# EAGLE design M7672 (EAGLE 6.6.0)
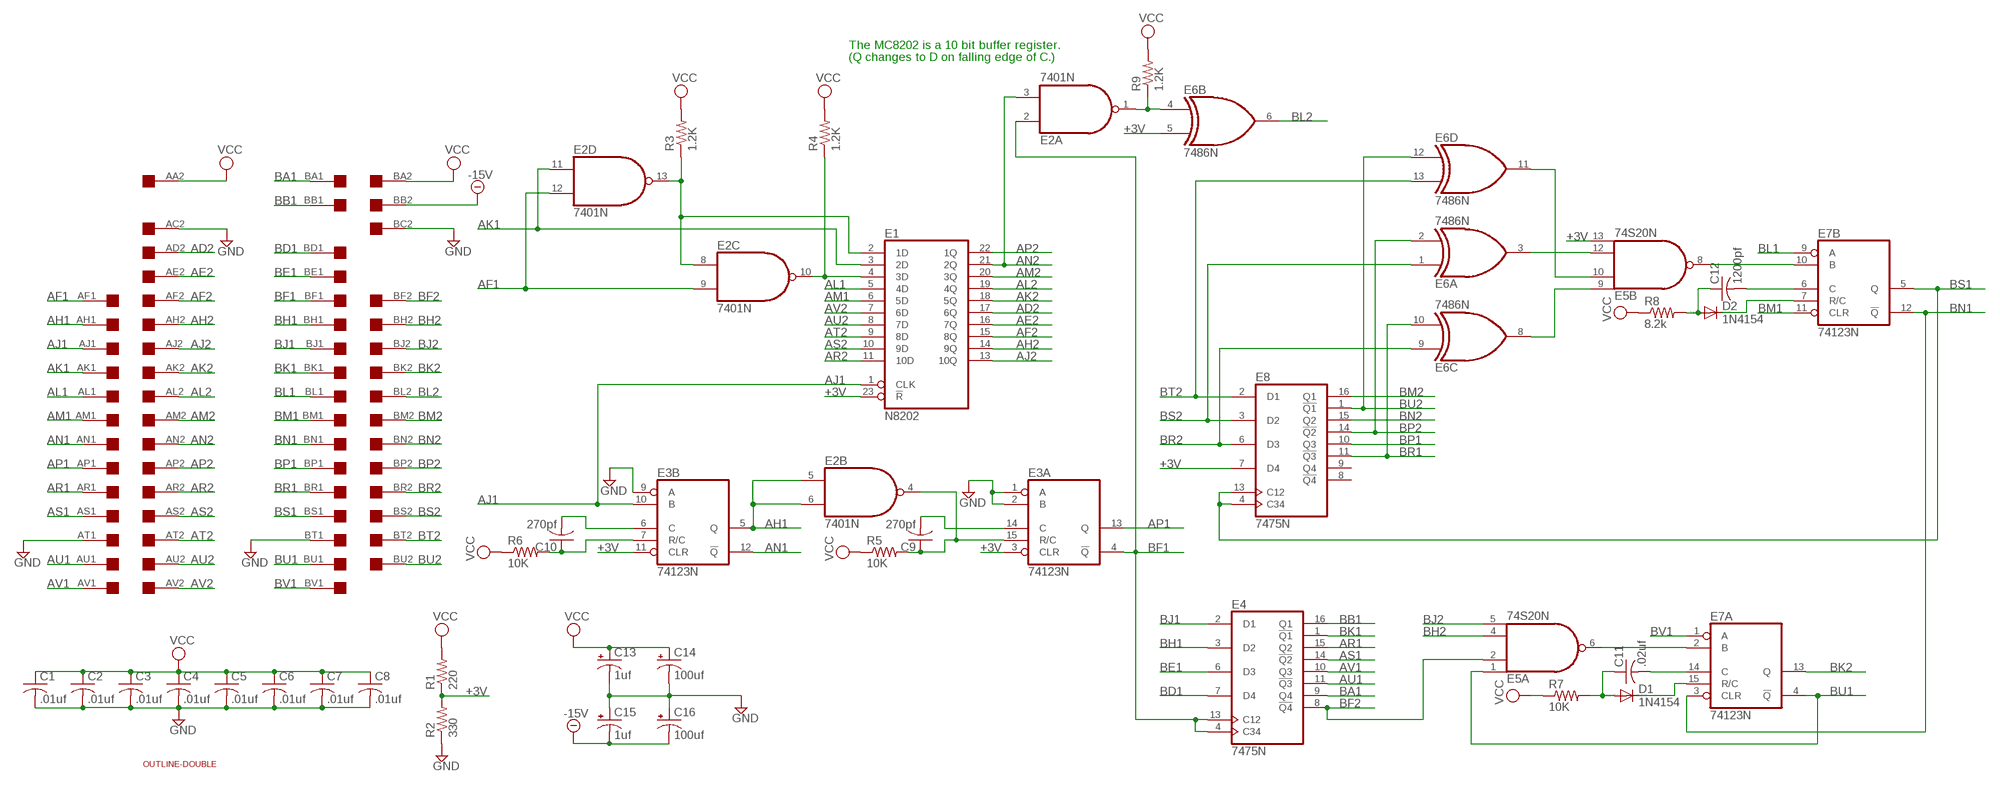
[diagram p0: schematic, sheet 1]

## Parts
C1  .01uf  C-US050-025X075  [C050-025X075]
C2  .01uf  C-US050-025X075  [C050-025X075]
C3  .01uf  C-US050-025X075  [C050-025X075]
C4  .01uf  C-US050-025X075  [C050-025X075]
C5  .01uf  C-US050-025X075  [C050-025X075]
C6  .01uf  C-US050-025X075  [C050-025X075]
C7  .01uf  C-US050-025X075  [C050-025X075]
C8  .01uf  C-US050-025X075  [C050-025X075]
C9  270pf  C-US050-025X075  [C050-025X075]
C10  270pf  C-US050-025X075  [C050-025X075]
C11  .02uf  C-US050-025X075  [C050-025X075]
C12  1200pf  C-US050-025X075  [C050-025X075]
C13  1uf  CPOL-USE30-10AXIAL  [E30-10]
C14  100uf  CPOL-USE30-10AXIAL  [E30-10]
C15  1uf  CPOL-USE30-10AXIAL  [E30-10]
C16  100uf  CPOL-USE30-10AXIAL  [E30-10]
D1  1N4154  1N4148DO35-10  [DO35-10]
D2  1N4154  1N4148DO35-10  [DO35-10]
E1  N8202  [DIL24]
E2  7401N  74LS01N  [DIL14]
E3  74123N  [DIL16]
E4  7475N  [DIL16]
E5  74S20N  [DIL14]
E6  7486N  [DIL14]
E7  74123N  [DIL16]
E8  7475N  [DIL16]
EDGE  DOUBLE  [EDGE-CON4]
R1  220  R-US_0207/10  [0207/10]
R2  330  R-US_0207/10  [0207/10]
R3  1.2K  R-US_0207/10  [0207/10]
R4  1.2K  R-US_0207/10  [0207/10]
R5  10K  R-US_0207/10  [0207/10]
R6  10K  R-US_0207/10  [0207/10]
R7  10K  R-US_0207/10  [0207/10]
R8  8.2k  R-US_0207/10  [0207/10]
R9  1.2K  R-US_0207/10  [0207/10]
U$2  OUTLINE-DOUBLE  [DOUBLE]

## Nets
+3V: E1.23(!R) E3.3(A:CLR) E3.11(B:CLR) E5.13(B:I3) E6.5(B:I1) E8.7(D4) R1.1 R2.2
-15V: C15.- C16.- EDGE.BB2
AD2: E1.17(6Q) EDGE.AD2
AE2: E1.16(7Q) EDGE.AE2
AF1: E2.9(C:I1) E2.12(D:I1) EDGE.AF1
AF2: E1.15(8Q) EDGE.AF2
AH1: E2.5(B:I0) E2.6(B:I1) E3.5(B:Q) EDGE.AH1
AH2: E1.14(9Q) EDGE.AH2
AJ1: E1.1(CLK) E3.10(B:B) EDGE.AJ1
AJ2: E1.13(10Q) EDGE.AJ2
AK1: E1.3(2D) E2.11(D:I0) EDGE.AK1
AK2: E1.18(5Q) EDGE.AK2
AL1: E1.5(4D) EDGE.AL1
AL2: E1.19(4Q) EDGE.AL2
AM1: E1.6(5D) EDGE.AM1
AM2: E1.20(3Q) EDGE.AM2
AN1: E3.12(B:!Q) EDGE.AN1
AN2: E1.21(2Q) E2.3(A:I1) EDGE.AN2
AP1: E3.13(A:Q) EDGE.AP1
AP2: E1.22(1Q) EDGE.AP2
AR1: E4.15(Q2) EDGE.AR1
AR2: E1.11(10D) EDGE.AR2
AS1: E4.14(!Q2) EDGE.AS1
AS2: E1.10(9D) EDGE.AS2
AT2: E1.9(8D) EDGE.AT2
AU1: E4.11(!Q3) EDGE.AU1
AU2: E1.8(7D) EDGE.AU2
AV1: E4.10(Q3) EDGE.AV1
AV2: E1.7(6D) EDGE.AV2
BA1: E4.9(Q4) EDGE.BA1
BB1: E4.16(Q1) EDGE.BB1
BD1: E4.7(D4) EDGE.BD1
BE1: E4.6(D3) EDGE.BE1
BF1: E2.2(A:I0) E3.4(A:!Q) E4.4(C34) E4.13(C12) EDGE.BF1
BF2: E4.8(!Q4) E5.2(A:I1) EDGE.BF2
BH1: E4.3(D2) EDGE.BH1
BH2: E5.4(A:I2) EDGE.BH2
BJ1: E4.2(D1) EDGE.BJ1
BJ2: E5.5(A:I3) EDGE.BJ2
BK1: E4.1(!Q1) EDGE.BK1
BK2: E7.13(A:Q) EDGE.BK2
BL1: E7.9(B:A) EDGE.BL1
BL2: E6.6(B:O) EDGE.BL2
BM1: E7.11(B:CLR) EDGE.BM1
BM2: E8.16(Q1) EDGE.BM2
BN1: E7.3(A:CLR) E7.12(B:!Q) EDGE.BN1
BN2: E8.15(Q2) EDGE.BN2
BP1: E8.10(Q3) EDGE.BP1
BP2: E6.2(A:I1) E8.14(!Q2) EDGE.BP2
BR1: E6.10(C:I1) E8.11(!Q3) EDGE.BR1
BR2: E6.9(C:I0) E8.6(D3) EDGE.BR2
BS1: E7.5(B:Q) E8.4(C34) E8.13(C12) EDGE.BS1
BS2: E6.1(A:I0) E8.3(D2) EDGE.BS2
BT2: E6.13(D:I1) E8.2(D1) EDGE.BT2
BU1: E5.1(A:I0) E7.4(A:!Q) EDGE.BU1
BU2: E6.12(D:I0) E8.1(!Q1) EDGE.BU2
BV1: E7.1(A:A) EDGE.BV1
GND [power]: C1.2 C2.2 C3.2 C4.2 C5.2 C6.2 C7.2 C8.2 C13.- C14.- C15.+ C16.+ E3.1(A:A) E3.2(A:B) E3.9(B:A) EDGE.AC2 EDGE.AT1 EDGE.BC2 EDGE.BT1 R2.1
N$1: E1.2(1D) E2.8(C:I0) E2.13(D:O) R3.1
N$2: E1.4(3D) E2.10(C:O) R4.1
N$3: E2.1(A:O) E6.4(B:I0) R9.1
N$4: E5.12(B:I2) E6.3(A:O)
N$5: C10.1 E3.7(B:R/C) R6.2
N$6: C10.2 E3.6(B:C)
N$7: C9.1 E2.4(B:O) E3.15(A:R/C) R5.2
N$8: C9.2 E3.14(A:C)
N$9: E5.10(B:I1) E6.11(D:O)
N$10: E5.9(B:I0) E6.8(C:O)
N$12: E5.6(A:O) E7.2(A:B)
N$13: D1.C E7.15(A:R/C)
N$14: C11.2 E7.14(A:C)
N$15: C11.1 D1.A R7.2
N$16: E5.8(B:O) E7.10(B:B)
N$17: D2.C E7.7(B:R/C)
N$18: C12.2 E7.6(B:C)
N$19: C12.1 D2.A R8.2
VCC [power]: C1.1 C2.1 C3.1 C4.1 C5.1 C6.1 C7.1 C8.1 C13.+ C14.+ EDGE.AA2 EDGE.BA2 R1.2 R3.2 R4.2 R5.1 R6.1 R7.1 R8.1 R9.2
Unconnected: E8.8(!Q4) E8.9(Q4) EDGE.AA1 EDGE.AB1 EDGE.AB2 EDGE.AC1 EDGE.AD1 EDGE.AE1 EDGE.BC1 EDGE.BD2 EDGE.BE2 EDGE.BV2

## Notes on the sheet
- The MC8202 is a 10 bit buffer register.
- (Q changes to D on falling edge of C.)

## Power pins joined to a net without a drawn wire
GND: E1.12(GND) E2.7(P:GND) E3.8(P:GND) E4.12(GND) E5.7(P:GND) E6.7(P:GND) E7.8(P:GND) E8.12(GND)
VCC: E1.24(VCC) E2.14(P:VCC) E3.16(P:VCC) E4.5(VCC) E5.14(P:VCC) E6.14(P:VCC) E7.16(P:VCC) E8.5(VCC)

## Library data of the parts
C1-C12 = rcl:C-US: CAPACITOR, American symbol
C13-C16 = rcl:CPOL-US: POLARIZED CAPACITOR, American symbol
D1 D2 = diode:1N4148: DIODE high speed (Philips)
E1 = dec-con:N8202: 10 bit register
E2 = 74xx-us:74*01: Quad 2-input NAND gate, open collector
E3 E7 = 74xx-us:74*123: Retriggerable monostable MULTIVIBRATOR
E4 E8 = 74xx-us:74*75: 4-bit bistable LATCH
E5 = 74xx-us:74*20: Dual 4-input NAND gate
E6 = 74xx-us:74*86: Quad 2-input EXCLUSIV-OR (XOR) gate
EDGE = dec-con:DOUBLE: Double-Height DEC board
R1-R9 = rcl:R-US_: RESISTOR, American symbol
U$2 = dec-con:OUTLINE-*: Board outlines for DEC boards.

## Net classes
1 power: width 0.508 mm

## Board
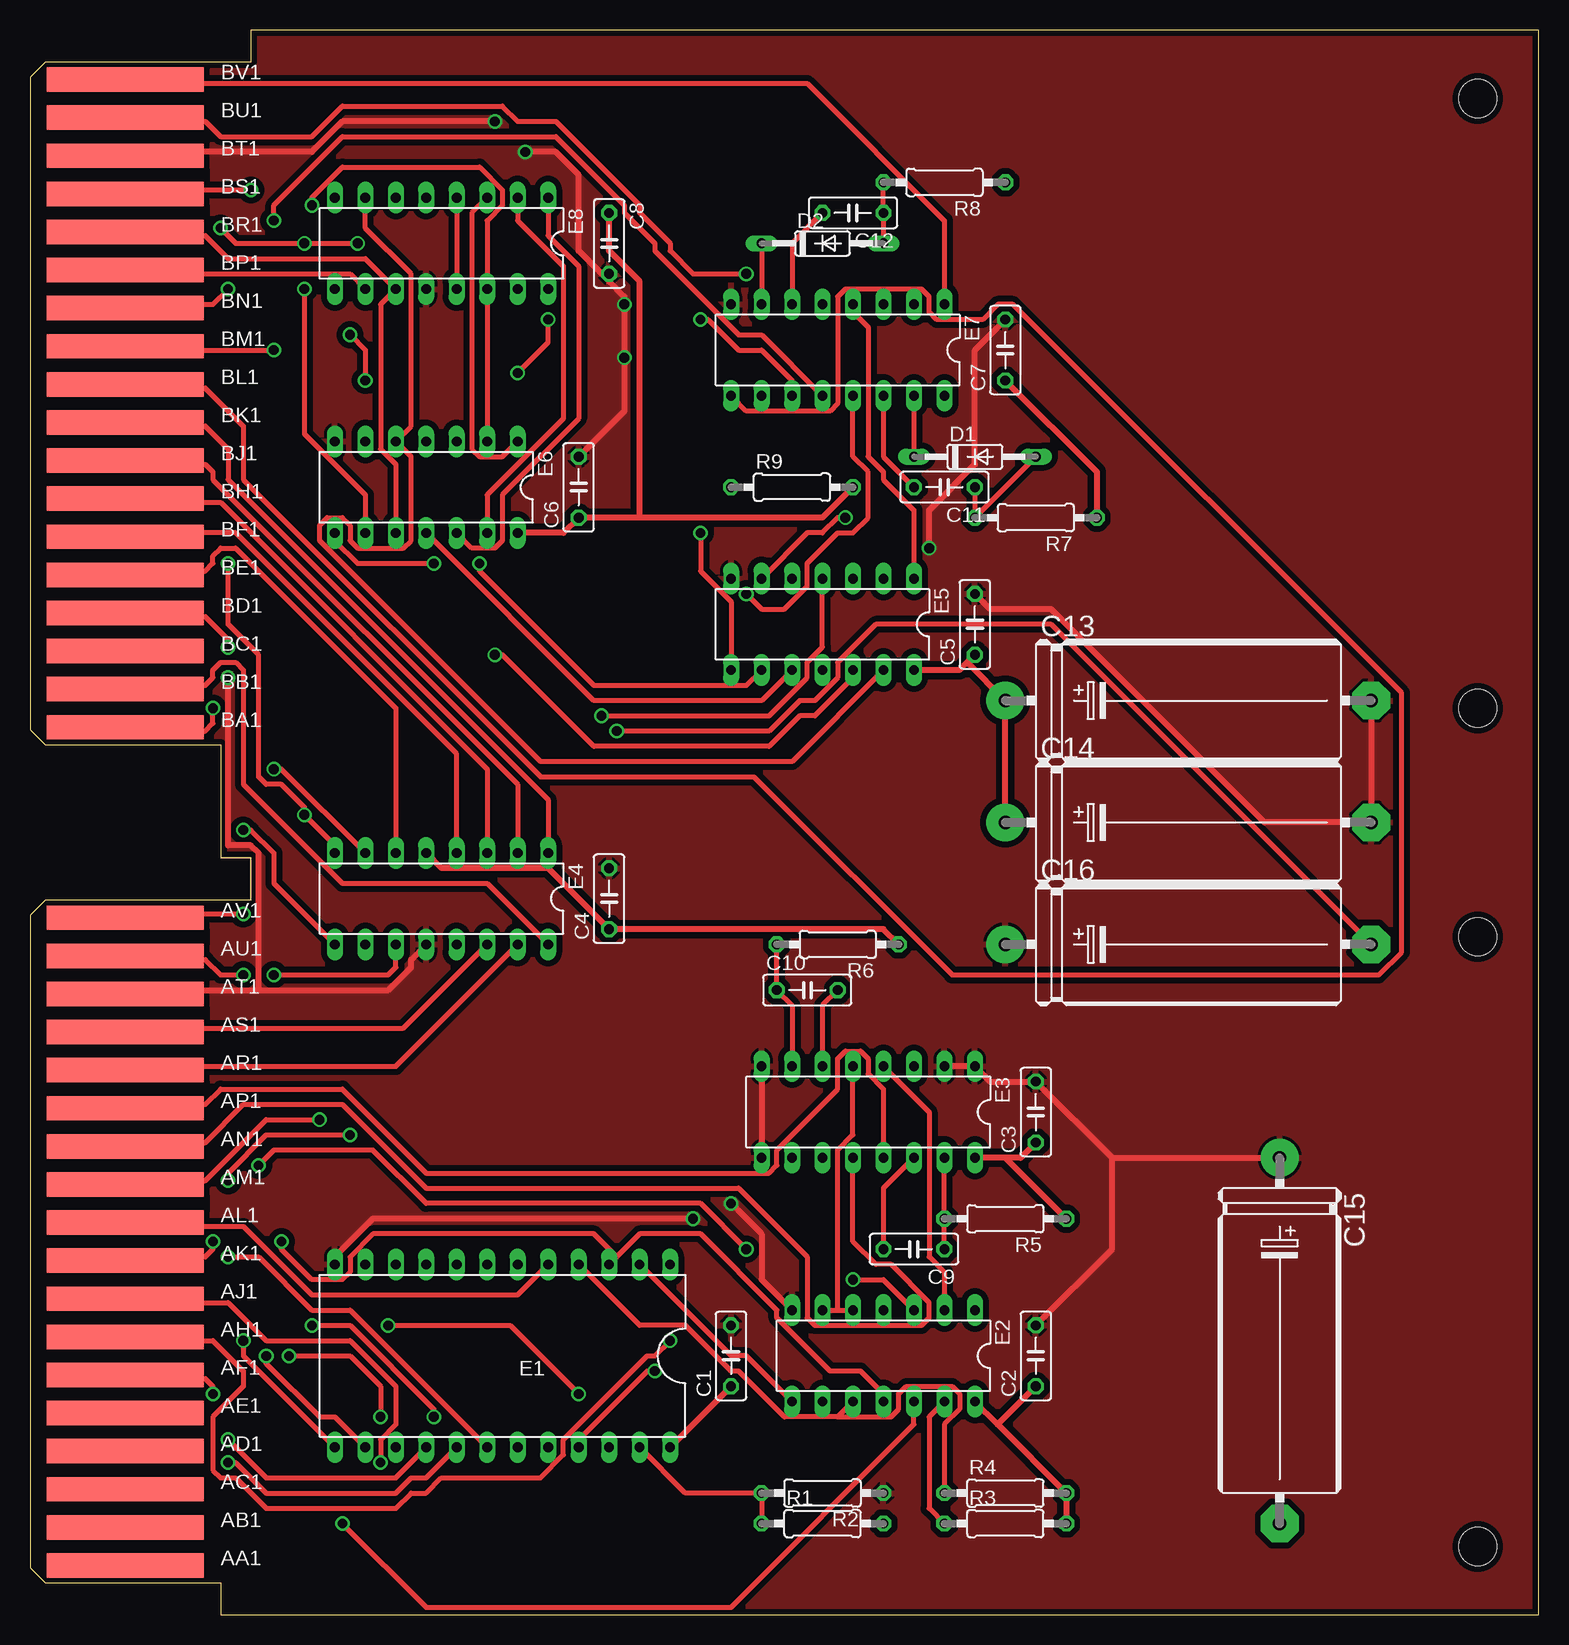
[diagram p1: board, top side]
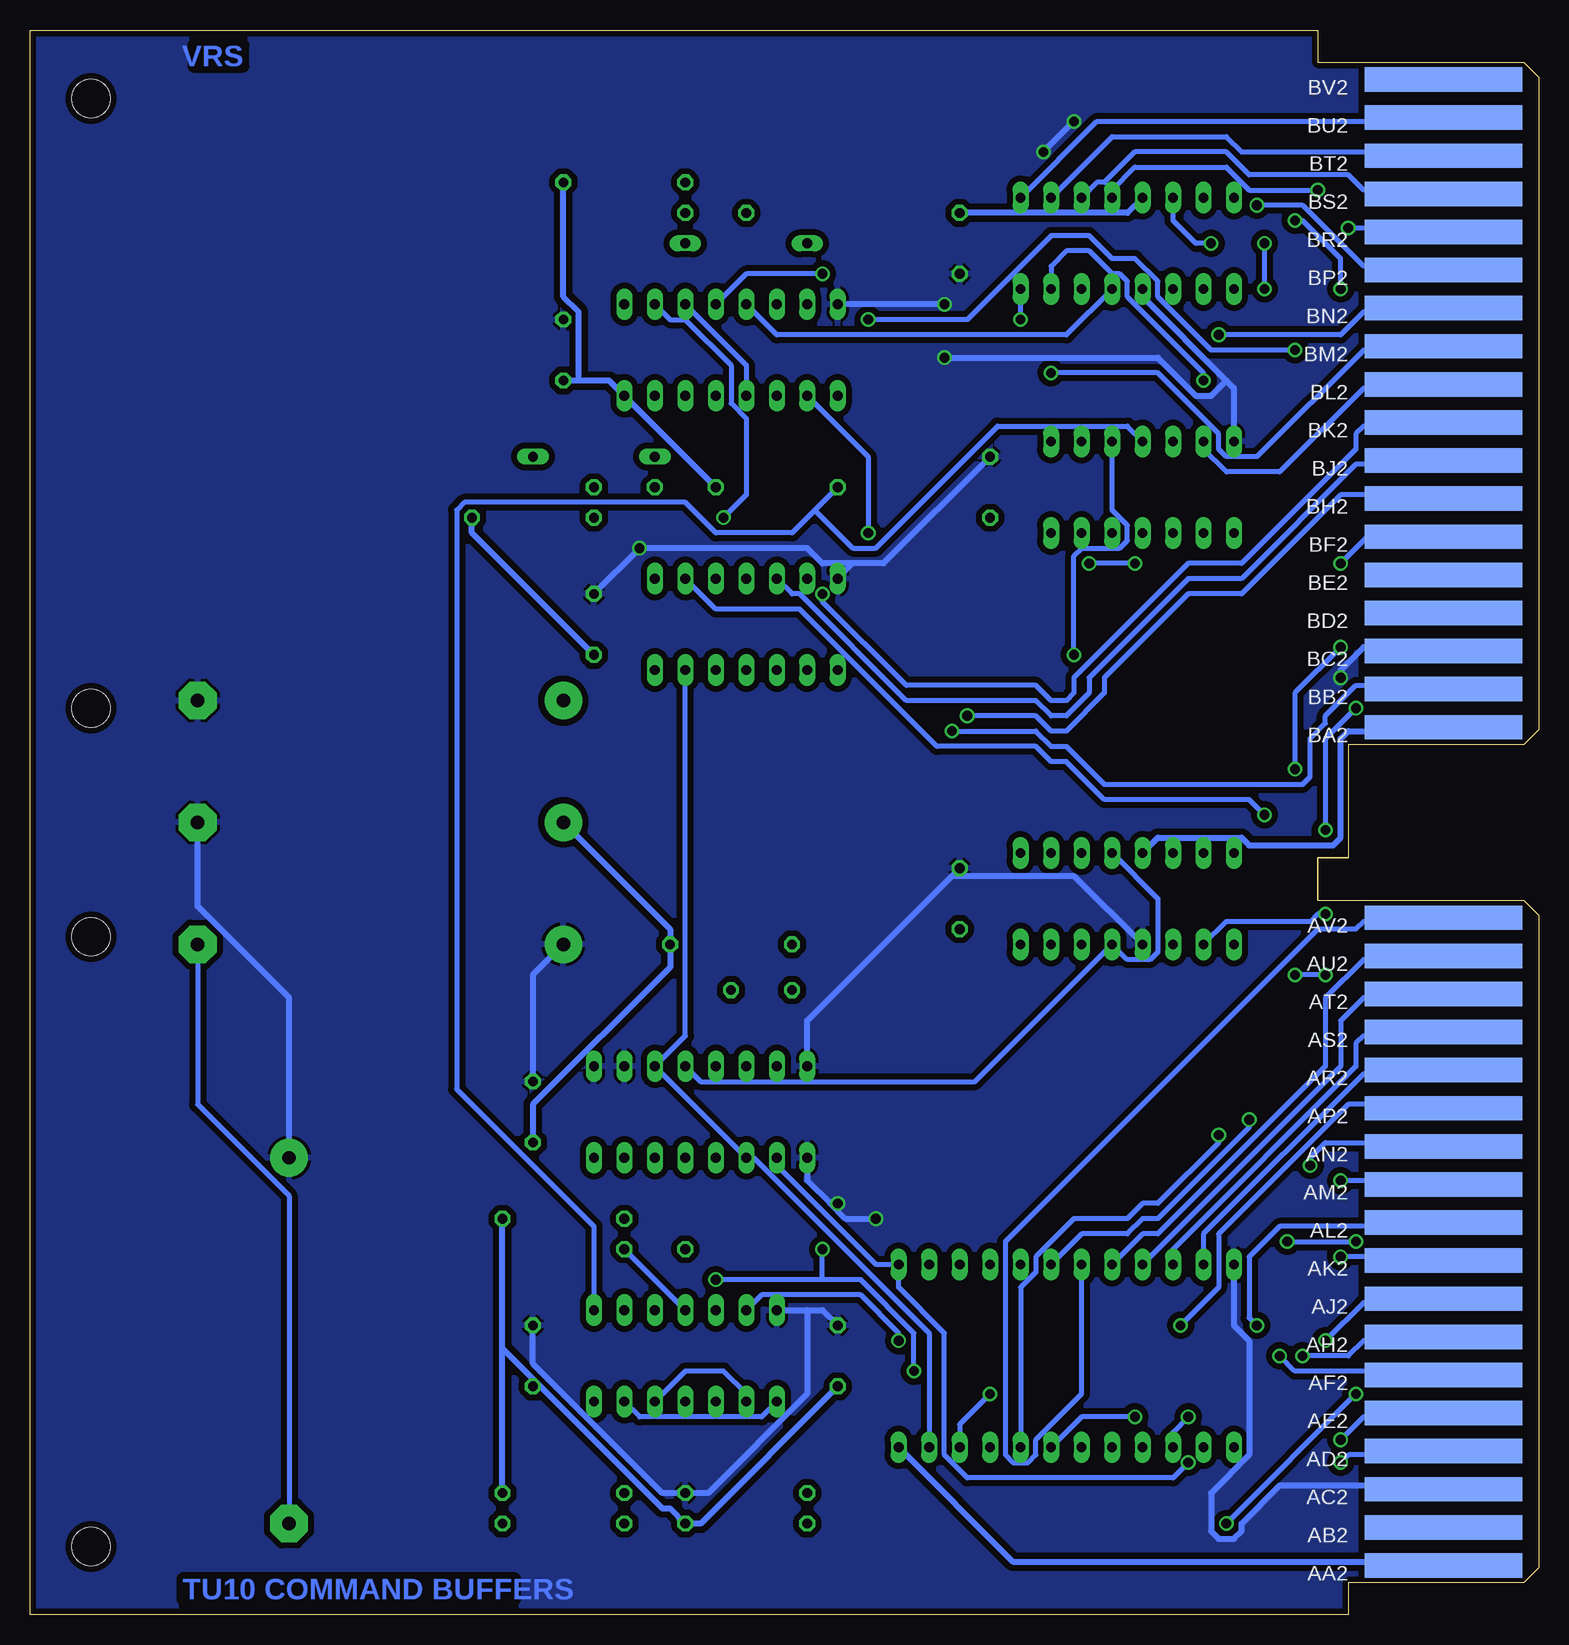
[diagram p2: board, bottom side, seen from below]

Size 125.73 x 132.08 mm. Coordinates in mm from the lower left corner, seen from the top.
Copper layers (1+16): Top 0.035mm / dielectric 1.5mm / Bottom 0.035mm
Design rules "16mils": minimum track width 16mil, minimum drill 32mil, track to track 15mil, track to pad 10mil, pad to pad 10mil, via to via 10mil, smd to smd 10mil, copper to edge 13mil, drill to drill 10mil, minimum pad ring 10mil, minimum via ring 8mil, stop-mask expansion 0mil, vias tented up to drill 0mil, thermal gap 10mil

### Footprints (pad centres in the part's own frame; a part is rotated, then mirrored left to right if it is on the bottom)
C050-025X075 = drill 0.813 octagon: 1 -2.54,0; 2 2.54,0
E30-10 = drill 1.118 pad 3.15: + -15.24,0 | drill 1.118 pad 3.15 octagon: - 15.24,0
DO35-10 = drill 0.813 long: A 5.08,0; C -5.08,0
DIL24 = drill 0.813 long: 1 -12.7,-7.62; 2 -10.16,-7.62; 3 -7.62,-7.62; 4 -5.08,-7.62; 5 -2.54,-7.62; 6 0,-7.62; 7 2.54,-7.62; 8 5.08,-7.62; 9 7.62,-7.62; 10 10.16,-7.62; 11 12.7,-7.62; 12 15.24,-7.62; 13 15.24,7.62; 14 12.7,7.62; 15 10.16,7.62; 16 7.62,7.62; 17 5.08,7.62; 18 2.54,7.62; 19 0,7.62; 20 -2.54,7.62; 21 -5.08,7.62; 22 -7.62,7.62; 23 -10.16,7.62; 24 -12.7,7.62
DIL14 = drill 0.813 long: 1 -7.62,-3.81; 2 -5.08,-3.81; 3 -2.54,-3.81; 4 0,-3.81; 5 2.54,-3.81; 6 5.08,-3.81; 7 7.62,-3.81; 8 7.62,3.81; 9 5.08,3.81; 10 2.54,3.81; 11 0,3.81; 12 -2.54,3.81; 13 -5.08,3.81; 14 -7.62,3.81
DIL16 = drill 0.813 long: 1 -8.89,-3.81; 2 -6.35,-3.81; 3 -3.81,-3.81; 4 -1.27,-3.81; 5 1.27,-3.81; 6 3.81,-3.81; 7 6.35,-3.81; 8 8.89,-3.81; 9 8.89,3.81; 10 6.35,3.81; 11 3.81,3.81; 12 1.27,3.81; 13 -1.27,3.81; 14 -3.81,3.81; 15 -6.35,3.81; 16 -8.89,3.81
EDGE-CON4 = smd 13.106 x 2.032: AA1 7.938,4.128; AB1 7.938,7.303; AC1 7.938,10.477; AD1 7.938,13.652; AE1 7.938,16.828; AF1 7.938,20.003; AH1 7.938,23.177; AJ1 7.938,26.352; AK1 7.938,29.527; AL1 7.938,32.703; AM1 7.938,35.877; AN1 7.938,39.053; AP1 7.938,42.227; AR1 7.938,45.403; AS1 7.938,48.578; AT1 7.938,51.752; AU1 7.938,54.928; AV1 7.938,58.102; BA1 7.938,73.978; BB1 7.938,77.153; BC1 7.938,80.328; BD1 7.938,83.502; BE1 7.938,86.677; BF1 7.938,89.853; BH1 7.938,93.028; BJ1 7.938,96.203; BK1 7.938,99.377; BL1 7.938,102.552; BM1 7.938,105.728; BN1 7.938,108.903; BP1 7.938,112.078; BR1 7.938,115.252; BS1 7.938,118.427; BT1 7.938,121.603; BU1 7.938,124.778; BV1 7.938,127.953 | smd 13.106 x 2.032 bottom: AA2 7.938,4.128; AB2 7.938,7.303; AC2 7.938,10.477; AD2 7.938,13.652; AE2 7.938,16.828; AF2 7.938,20.003; AH2 7.938,23.177; AJ2 7.938,26.352; AK2 7.938,29.527; AL2 7.938,32.703; AM2 7.938,35.877; AN2 7.938,39.053; AP2 7.938,42.227; AR2 7.938,45.403; AS2 7.938,48.578; AT2 7.938,51.752; AU2 7.938,54.928; AV2 7.938,58.102; BA2 7.938,73.978; BB2 7.938,77.153; BC2 7.938,80.328; BD2 7.938,83.502; BE2 7.938,86.677; BF2 7.938,89.853; BH2 7.938,93.028; BJ2 7.938,96.203; BK2 7.938,99.377; BL2 7.938,102.552; BM2 7.938,105.728; BN2 7.938,108.903; BP2 7.938,112.078; BR2 7.938,115.252; BS2 7.938,118.427; BT2 7.938,121.603; BU2 7.938,124.778; BV2 7.938,127.953
0207/10 = drill 0.813 octagon: 1 -5.08,0; 2 5.08,0
DOUBLE = hole 3.175: 120.65,56.515; 120.65,5.715; 120.65,75.565; 120.65,126.365

### Placement (x,y rotation side)
C1  58.42,21.59 90 top
C2  83.82,21.59 90 top
C3  83.82,41.91 90 top
C4  48.26,59.69 90 top
C5  78.74,82.55 90 top
C6  45.72,93.98 90 top
C7  81.28,105.41 90 top
C8  48.26,114.3 270 top
C9  73.66,30.48 180 top
C10  64.77,52.07 0 top
C11  76.2,93.98 180 top
C12  68.58,116.84 180 top
C13  96.52,76.2 0 top
C14  96.52,66.04 0 top
C15  104.14,22.86 270 top
C16  96.52,55.88 0 top
D1  78.74,96.52 0 top
D2  66.04,114.3 0 top
E1  40.64,21.59 180 top
E2  71.12,21.59 180 top
E3  69.85,41.91 180 top
E4  34.29,59.69 180 top
E5  66.04,82.55 180 top
E6  33.02,93.98 180 top
E7  67.31,105.41 180 top
E8  34.29,114.3 180 top
EDGE  0,0 0 top
R1  66.04,7.62 0 top
R2  66.04,10.16 180 top
R3  81.28,7.62 0 top
R4  81.28,10.16 0 top
R5  81.28,33.02 180 top
R6  67.31,55.88 180 top
R7  83.82,91.44 180 top
R8  76.2,119.38 180 top
R9  63.5,93.98 0 top
U$2  0,0 0 top

### Tracks (layer width: path | path; a pad name or v marks a point on that pad's centre or on a via)
+3V
  Top 0.406: E8.7 27.94,115.57 31.75,111.76 31.75,99.06 E6.5 31.75,96.52 31.75,89.53 31.12,88.9 27.31,88.9 26.67,89.53 26.67,90.81 26.04,91.44 24.77,91.44 24.13,90.81 24.13,89.53 42.55,71.12 63.5,71.12 E5.13 | R1.1 R2.2 54.61,10.16 E1.23
  Bottom 0.406: E5.13 71.12,48.26 E3.3 E3.11 65.41,38.1 50.8,23.5 E1.23
-15V  (via drill 0.81)
  Top 0.406: v48.9,73.66 61.6,73.66 64.14,76.2 65.41,76.2 67.31,78.11 67.31,79.38 70.49,82.55 85.09,82.55 C16.-
  Bottom 0.406: C15.- 104.14,34.92 111.76,42.55 C16.- | v48.9,73.66 41.91,73.66 40.64,72.39 39.37,72.39 36.2,69.22 19.69,69.22 19.05,69.85 19.05,73.03 17.78,74.3 17.78,74.93 15.24,77.47 8.26,77.47 EDGE.BB2
AD2  (via drill 0.81)
  Top 0.406: E1.17 33.02,11.43 31.75,11.43 30.48,10.16 19.69,10.16 17.15,12.7 v16.51,12.7
  Bottom 0.406: v16.51,12.7 15.88,13.34 12.07,13.34 11.43,13.97 8.26,13.97 EDGE.AD2
AE2  (via drill 0.81)
  Top 0.406: E1.16 30.48,11.43 19.69,11.43 v16.51,14.61
  Bottom 0.406: v16.51,14.61 14.61,16.51 12.07,16.51 11.43,17.14 8.26,17.14 EDGE.AE2
AF1  (via drill 0.81)
  Top 0.406: E2.12 73.66,15.88 58.42,0.64 33.02,0.64 v26.04,7.62 | v15.24,18.41 15.24,19.05 14.61,19.68 12.07,19.68 11.43,20.32 8.26,20.32 EDGE.AF1
  Bottom 0.406: E2.12 71.12,20.32 67.95,20.32 66.04,18.41 E2.9 | v15.24,18.41 v26.04,7.62
AF2  (via drill 0.81)
  Top 0.406: v29.21,16.51 29.21,19.05 26.67,21.59 v21.59,21.59
  Bottom 0.406: E1.15 30.48,15.24 v29.21,16.51 | v21.59,21.59 20.32,20.32 8.26,20.32 EDGE.AF2
AH1  (via drill 0.81)
  Top 0.406: E2.6 67.31,25.4 | 67.31,25.4 E2.5 | E3.5 68.58,40.01 67.31,38.73 67.31,25.4 | v53.34,22.86 52.07,21.59 51.44,21.59 44.45,14.61 44.45,13.34 42.55,11.43 34.29,11.43 33.02,10.16 31.75,10.16 30.48,8.89 19.69,8.89 17.15,11.43 15.88,11.43 15.24,12.06 15.24,16.51 17.78,19.05 17.78,20.32 15.24,22.86 12.07,22.86 11.43,23.5 8.26,23.5 EDGE.AH1
  Bottom 0.406: E2.6 64.77,26.67 56.52,26.67 53.34,23.5 v53.34,22.86
AH2  (via drill 0.81)
  Top 0.406: E1.14 25.4,16.51 24.13,16.51 19.69,20.95 v19.69,21.59
  Bottom 0.406: v19.69,21.59 15.88,21.59 14.61,22.86 12.07,22.86 11.43,23.5 8.26,23.5 EDGE.AH2
AJ1  (via drill 0.81)
  Top 0.406: v29.21,12.7 29.21,14.61 30.48,15.88 30.48,19.05 26.67,22.86 19.69,22.86 16.51,26.04 12.07,26.04 11.43,26.67 8.26,26.67 EDGE.AJ1
  Bottom 0.406: E3.10 63.5,37.47 55.25,29.21 E1.1 53.34,27.3 49.53,23.5 49.53,13.34 47.63,11.43 30.48,11.43 v29.21,12.7
AJ2  (via drill 0.81)
  Top 0.406: E1.13 17.78,21.59 v17.78,22.86
  Bottom 0.406: v17.78,22.86 14.61,26.04 12.07,26.04 11.43,26.67 8.26,26.67 EDGE.AJ2
AK1  (via drill 0.81)
  Top 0.406: 48.9,29.84 50.8,31.75 55.88,31.75 62.23,25.4 62.23,24.77 66.68,20.32 69.22,20.32 71.12,18.41 E2.11 | 48.9,29.84 E1.3 | v15.24,31.11 15.24,30.48 14.61,29.84 8.26,29.84 EDGE.AK1 | v20.96,31.11 20.96,30.48 23.5,27.94 26.04,27.94 26.67,28.57 26.67,29.84 28.58,31.75 46.99,31.75 48.9,29.84
  Bottom 0.406: v20.96,31.11 v15.24,31.11
AK2  (via drill 0.81)
  Top 0.406: E1.18 26.67,25.4 23.5,25.4 19.05,29.84 v16.51,29.84
  Bottom 0.406: v16.51,29.84 8.26,29.84 EDGE.AK2
AL1
  Top 0.406: E1.5 40.64,26.67 23.5,26.67 17.78,32.38 8.26,32.38 EDGE.AL1
AL2  (via drill 0.81)
  Top 0.406: v33.66,16.51 33.66,17.14 26.67,24.13 v23.5,24.13
  Bottom 0.406: E1.19 38.1,16.51 v33.66,16.51 | v23.5,24.13 24.13,24.77 24.13,29.84 21.59,32.38 12.07,32.38 11.43,33.02 8.26,33.02 EDGE.AL2
AM1  (via drill 0.81)
  Top 0.406: v24.13,41.27 19.69,41.27 14.61,36.2 8.26,36.2 EDGE.AM1
  Bottom 0.406: E1.6 38.1,31.75 34.29,31.75 33.02,33.02 31.75,33.02 24.13,40.64 v24.13,41.27
AM2  (via drill 0.81)
  Top 0.406: v26.67,40.01 19.69,40.01 16.51,36.83 v16.51,36.2
  Bottom 0.406: E1.20 43.18,27.3 41.91,28.57 41.91,29.84 38.74,33.02 34.29,33.02 33.02,34.29 31.75,34.29 26.67,39.37 v26.67,40.01 | v16.51,36.2 8.26,36.2 EDGE.AM2
AN1
  Top 0.406: E3.12 68.58,31.11 70.49,29.21 71.76,29.21 74.93,26.04 74.93,24.77 74.3,24.13 65.41,24.13 64.77,24.77 64.77,29.84 59.06,35.56 33.02,35.56 26.04,42.55 17.78,42.55 14.61,39.37 8.26,39.37 EDGE.AN1
AN2  (via drill 0.81)
  Top 0.406: E2.3 71.12,27.94 v68.58,27.94 | v52.07,20.32 51.44,20.32 45.72,14.61 E1.21 | v19.05,37.47 20.32,38.73 28.58,38.73 33.02,34.29 55.88,34.29 v59.69,30.48
  Bottom 0.406: 59.69,27.94 56.52,27.94 52.07,23.5 v52.07,20.32 | 59.69,27.94 v68.58,27.94 | v19.05,37.47 19.05,38.1 17.78,39.37 8.26,39.37 EDGE.AN2 | 59.69,27.94 v59.69,30.48
AP1
  Top 0.406: E3.13 71.12,43.81 69.85,45.09 69.85,46.35 69.22,46.99 67.95,46.99 67.31,46.35 67.31,43.81 62.23,38.73 62.23,37.47 61.6,36.83 33.02,36.83 26.04,43.81 15.88,43.81 14.61,42.55 8.26,42.55 EDGE.AP1
AP2  (via drill 0.81)
  Top 0.406: v45.72,18.41 40.01,24.13 v29.85,24.13
  Bottom 0.406: E1.22 48.26,15.88 v45.72,18.41 | v29.85,24.13 26.67,27.3 26.67,31.75 15.88,42.55 8.26,42.55 EDGE.AP2
AR1
  Top 0.406: E4.15 30.48,45.72 8.26,45.72 EDGE.AR1
AR2
  Bottom 0.406: E1.11 27.94,31.75 14.61,45.09 8.26,45.09 EDGE.AR2
AS1
  Top 0.406: E4.14 31.12,48.9 8.26,48.9 EDGE.AS1
AS2
  Bottom 0.406: E1.10 30.48,30.48 15.24,45.72 15.24,47.62 14.61,48.26 8.26,48.26 EDGE.AS2
AT2
  Bottom 0.406: E1.9 16.51,45.72 16.51,49.53 14.61,51.44 8.26,51.44 EDGE.AT2
AU1  (via drill 0.81)
  Top 0.406: E4.11 30.48,53.98 29.85,53.34 v20.32,53.34 | v17.78,53.34 15.88,53.34 14.61,54.61 12.07,54.61 11.43,55.24 8.26,55.24 EDGE.AU1
  Bottom 0.406: v17.78,53.34 v20.32,53.34
AU2
  Bottom 0.406: E1.8 33.02,31.75 31.75,31.75 17.78,45.72 17.78,51.44 14.61,54.61 8.26,54.61 EDGE.AU2
AV1  (via drill 0.81)
  Top 0.406: v17.78,58.42 8.26,58.42 EDGE.AV1
  Bottom 0.406: E4.10 26.04,57.78 19.05,57.78 18.42,58.42 v17.78,58.42
AV2
  Bottom 0.406: E1.7 38.1,18.41 41.91,14.61 41.91,13.34 42.55,12.7 43.82,12.7 44.45,13.34 44.45,31.11 18.42,57.15 15.24,57.15 14.61,57.78 8.26,57.78 EDGE.AV2
BA1  (via drill 0.81)
  Top 0.406: E4.9 20.32,60.96 20.32,63.5 18.42,65.41 v17.78,65.41 | v15.24,75.56 15.24,74.3 14.61,73.66 10.16,73.66 9.53,74.3 8.26,74.3 EDGE.BA1
  Bottom 0.406: v17.78,65.41 17.78,73.03 v15.24,75.56
BB1
  Top 0.406: E4.16 38.1,60.96 26.04,60.96 17.78,69.22 17.78,78.74 17.15,79.38 15.88,79.38 15.24,78.74 15.24,78.11 14.61,77.47 8.26,77.47 EDGE.BB1
BD1  (via drill 0.81)
  Top 0.406: E4.7 20.96,70.48 v20.32,70.48 | v16.51,80.64 16.51,81.28 14.61,83.19 12.07,83.19 11.43,83.82 8.26,83.82 EDGE.BD1
  Bottom 0.406: v20.32,70.48 20.32,76.83 v16.51,80.64
BE1
  Top 0.406: E4.6 30.48,75.56 17.15,88.9 15.88,88.9 15.24,88.27 15.24,87.63 14.61,87 8.26,87 EDGE.BE1
BF1
  Top 0.406: E2.2 76.2,28.57 74.93,29.84 74.93,41.91 E3.4 | E4.4 35.56,71.75 17.15,90.17 8.26,90.17 EDGE.BF1
  Bottom 0.406: E4.4 31.75,59.69 31.75,55.24 32.39,54.61 34.29,54.61 E4.13 46.99,44.45 69.85,44.45 E3.4
BF2  (via drill 0.81)
  Top 0.406: E4.8 25.4,64.14 v22.86,66.67 22.86,67.31 20.96,69.22 19.69,69.22 19.05,69.85 19.05,80.01 16.51,82.55 v16.51,87.63
  Bottom 0.406: E5.2 68.58,83.82 61.6,83.82 50.17,72.39 41.91,72.39 40.64,71.12 39.37,71.12 36.2,67.94 24.13,67.94 v22.86,66.67 | v16.51,87.63 13.97,90.17 8.26,90.17 EDGE.BF2
BH1
  Top 0.406: E4.3 38.1,70.48 15.88,92.71 8.26,92.71 EDGE.BH1
BH2  (via drill 0.81)
  Top 0.406: E5.4 66.04,80.64 64.77,79.38 64.77,78.11 61.6,74.93 v47.63,74.93
  Bottom 0.406: v47.63,74.93 41.91,74.93 40.64,73.66 39.37,73.66 36.2,76.83 36.2,78.11 29.21,85.09 24.77,85.09 16.51,93.34 8.26,93.34 EDGE.BH2
BJ1
  Top 0.406: E4.2 40.64,69.22 15.24,94.61 15.24,95.25 14.61,95.89 8.26,95.89 EDGE.BJ1
BJ2
  Bottom 0.406: E5.5 62.23,85.09 61.6,85.09 52.71,76.2 41.91,76.2 40.64,74.93 39.37,74.93 37.47,76.83 37.47,78.11 29.21,86.36 24.77,86.36 15.24,95.89 8.26,95.89 EDGE.BJ2
BK1
  Top 0.406: E4.1 43.18,67.94 16.51,94.61 16.51,97.16 14.61,99.06 8.26,99.06 EDGE.BK1
BK2  (via drill 0.81)
  Top 0.406: E7.13 68.58,96.52 69.85,95.25 69.85,91.44 68.58,90.17 67.31,90.17 64.77,87.63 64.77,85.72 62.87,83.82 60.96,83.82 v59.69,85.09
  Bottom 0.406: v59.69,85.09 59.69,84.45 52.71,77.47 41.91,77.47 40.64,76.2 39.37,76.2 38.74,76.83 38.74,78.11 29.21,87.63 24.77,87.63 15.24,97.16 15.24,98.42 14.61,99.06 12.07,99.06 11.43,99.69 8.26,99.69 EDGE.BK2
BL1
  Top 0.406: E7.9 59.69,100.33 66.68,100.33 67.31,100.97 67.31,109.86 67.95,110.49 74.3,110.49 74.93,109.86 74.93,108.58 75.57,107.95 79.38,107.95 80.65,109.22 81.92,109.22 114.3,76.83 114.3,55.24 112.4,53.34 76.84,53.34 60.33,69.85 42.55,69.85 17.78,94.61 17.78,99.06 14.61,102.23 8.26,102.23 EDGE.BL1
BL2
  Bottom 0.406: E6.6 27.94,97.16 26.04,95.25 21.59,95.25 14.61,102.23 8.26,102.23 EDGE.BL2
BM1  (via drill 0.81)
  Top 0.406: E7.11 63.5,102.87 60.96,105.41 59.06,105.41 56.52,107.95 v55.88,107.95 | v20.32,105.41 12.07,105.41 11.43,106.05 8.26,106.05 EDGE.BM1
  Bottom 0.406: v55.88,107.95 47.63,107.95 40.64,114.94 37.47,114.94 35.56,113.03 33.66,113.03 31.75,111.12 31.75,109.86 27.31,105.41 v20.32,105.41
BM2  (via drill 0.81)
  Top 0.406: v43.18,107.95 43.18,106.05 v40.64,103.5
  Bottom 0.406: v43.18,107.95 E8.16 | v40.64,103.5 31.75,103.5 26.67,98.42 26.67,97.16 26.04,96.52 23.5,96.52 14.61,105.41 12.07,105.41 11.43,106.05 8.26,106.05 EDGE.BM2
BN1  (via drill 0.81)
  Top 0.406: E7.12 60.96,106.68 59.06,106.68 52.07,113.67 52.07,114.3 49.53,116.84 49.53,117.47 43.82,123.19 26.04,123.19 20.32,117.47 v20.32,116.2 | v16.51,110.49 15.24,109.22 8.26,109.22 EDGE.BN1
  Bottom 0.406: E7.12 66.04,104.14 E7.3 | v20.32,116.2 19.69,116.2 16.51,113.03 v16.51,110.49
BN2  (via drill 0.81)
  Top 0.406: v27.94,102.87 27.94,105.41 v26.67,106.68
  Bottom 0.406: E8.15 40.64,112.39 39.37,113.67 37.47,113.67 35.56,111.76 34.93,111.76 34.29,111.12 34.29,109.86 27.94,103.5 v27.94,102.87 | v26.67,106.68 16.51,106.68 14.61,108.58 12.07,108.58 11.43,109.22 8.26,109.22 EDGE.BN2
BP1
  Top 0.406: E8.10 26.67,111.76 8.26,111.76 EDGE.BP1
BP2  (via drill 0.81)
  Top 0.406: E6.2 E8.14 38.1,116.2 39.37,117.47 39.37,118.75 37.47,120.65 26.04,120.65 23.5,118.11 v23.5,117.47
  Bottom 0.406: v23.5,117.47 19.69,117.47 14.61,112.39 8.26,112.39 EDGE.BP2
BR1
  Top 0.406: E6.10 30.48,95.89 29.21,97.16 29.21,109.22 E8.11 27.94,113.03 16.51,113.03 14.61,114.94 8.26,114.94 EDGE.BR1
BR2  (via drill 0.81)
  Top 0.406: v27.31,114.3 v22.86,114.3 17.15,114.3 v15.88,115.57 | E6.9 27.94,93.34 22.86,98.42 v22.86,110.49
  Bottom 0.406: E8.6 30.48,116.2 28.58,114.3 v27.31,114.3 | v15.88,115.57 8.26,115.57 EDGE.BR2 | v22.86,114.3 v22.86,110.49
BS1  (via drill 0.81)
  Top 0.406: E8.4 E8.13 | v18.42,118.75 8.26,118.75 EDGE.BS1
  Bottom 0.406: E7.5 63.5,106.68 39.37,106.68 E8.13 | v18.42,118.75 24.13,118.75 26.04,120.65 33.66,120.65 35.56,118.75 E8.4
BS2
  Top 0.406: E6.1 39.37,96.52 37.47,96.52 36.83,97.16 36.83,116.84 E8.3
  Bottom 0.406: E8.3 36.83,119.38 36.2,119.38 33.66,121.92 26.04,121.92 24.13,120.02 15.88,120.02 14.61,118.75 8.26,118.75 EDGE.BS2
BT2
  Top 0.406: E6.13 38.1,93.34 44.45,99.69 44.45,112.39 40.64,116.2 E8.2
  Bottom 0.406: E8.2 35.56,123.19 26.04,123.19 24.77,121.92 8.26,121.92 EDGE.BT2
BU1  (via drill 0.81)
  Top 0.406: E5.1 73.66,92.08 71.12,94.61 71.12,95.25 69.85,96.52 69.85,107.31 68.58,108.58 E7.4 | v59.69,111.76 55.25,111.76 53.34,113.67 53.34,114.3 50.8,116.84 50.8,117.47 43.82,124.46 40.64,124.46 39.37,125.73 26.04,125.73 23.5,123.19 15.88,123.19 14.61,124.46 12.07,124.46 11.43,125.09 8.26,125.09 EDGE.BU1
  Bottom 0.406: E7.4 66.04,111.76 v59.69,111.76
BU2
  Top 0.406: E6.12 36.83,88.9 38.74,88.9 39.37,89.53 39.37,93.34 45.72,99.69 45.72,112.39 43.18,114.94 E8.1
  Bottom 0.406: E8.1 36.83,124.46 8.26,124.46 EDGE.BU2
BV1
  Top 0.406: E7.1 76.2,116.2 64.77,127.64 8.26,127.64 EDGE.BV1
GND  (via drill 0.81)
  Top 0.508: C6.2 49.53,100.33 v49.53,104.78 v49.53,109.22 49.53,109.86 48.26,111.12 | C7.2 78.74,105.41 78.74,95.89 74.93,92.08 v74.93,88.9 | v38.74,124.46 26.04,124.46 23.5,121.92 8.26,121.92 EDGE.BT1 | v41.28,121.92 43.82,121.92 45.72,120.02 45.72,113.67 48.26,111.12 | 48.26,111.12 C8.2 | C13.- C14.- 102.87,66.04 85.09,83.82 80.01,83.82 C5.2 | E3.2 E3.1 80.01,44.45 C3.2 90.17,38.1 | 90.17,38.1 C15.+ | E4.12 31.75,54.61 31.75,53.98 29.85,52.07 19.05,52.07 | 19.05,52.07 8.26,52.07 EDGE.AT1 | v16.51,78.11 16.51,64.14 18.42,64.14 19.05,63.5 19.05,52.07 | E3.8 E3.9 | E1.12 25.4,29.84 28.58,33.02 v55.25,33.02 | E2.7 60.96,27.94 60.96,31.75 v58.42,34.29 | 90.17,38.1 90.17,30.48 C2.2
  Bottom 0.508: E6.7 25.4,102.23 26.04,102.87 | 26.04,102.87 33.02,109.86 E8.12 | 57.15,87.63 E5.7 | 57.15,87.63 54.61,87.63 C6.2 | C5.2 v74.93,88.9 60.96,88.9 59.69,87.63 57.15,87.63 | v49.53,109.22 E7.8 | 26.04,102.87 27.31,101.6 28.58,101.6 31.75,104.78 v49.53,104.78 | v41.28,121.92 v38.74,124.46 | C3.2 83.82,53.34 C16.+ | C14.- 111.76,59.05 104.14,51.44 C15.+ | v16.51,78.11 16.51,78.74 14.61,80.64 8.26,80.64 EDGE.BC2 | C1.2 59.69,25.4 60.96,25.4 | E2.7 60.96,25.4 | 60.96,25.4 60.96,18.41 69.22,10.16 R2.1 73.03,10.16 83.82,20.95 C2.2 | v55.25,33.02 57.79,33.02 59.06,34.29 | 59.06,34.29 60.96,36.2 E3.9 | 48.9,61.59 60.96,49.53 E3.8 | 48.9,61.59 C4.2 | E1.12 25.4,24.13 24.13,22.86 24.13,13.34 27.31,10.16 27.31,6.99 26.67,6.35 25.4,6.35 24.77,6.99 24.77,7.62 21.59,10.79 8.26,10.79 EDGE.AC2 | 59.06,34.29 v58.42,34.29 | E4.12 38.74,61.59 48.9,61.59
  pour Bottom (isolate 0.508): 125.73,0 15.24,0 15.24,132.08 125.73,132.08
  pour Top (isolate 0.508): 125.73,0 15.24,0 15.24,132.08 125.73,132.08
N$1
  Top 0.406: R3.1 74.93,8.89 74.93,16.51 E2.13 | E1.2 58.42,21.59 59.69,21.59 E2.8
  Bottom 0.406: E2.13 74.93,16.51 64.77,16.51 E2.8
N$2
  Top 0.406: E1.4 50.8,24.13 54.61,24.13 58.42,20.32 59.06,20.32 62.87,16.51 67.31,16.51 | E2.10 67.31,16.51 | R4.1 76.2,15.88 77.47,17.14 77.47,18.41 76.84,19.05 73.03,19.05 72.39,18.41 72.39,17.14 71.76,16.51 67.31,16.51
N$3
  Bottom 0.406: E2.1 78.74,32.38 90.17,43.81 90.17,92.08 89.54,92.71 71.12,92.71 68.58,90.17 62.23,90.17 60.33,92.08 | R9.1 60.33,92.08 | E6.4 34.29,99.06 45.09,99.06 55.25,88.9 57.15,88.9 60.33,92.08
N$4  (via drill 0.81)
  Top 0.406: v38.74,80.01 39.37,80.01 46.99,72.39 61.6,72.39 64.14,74.93 65.41,74.93 68.58,78.11 E5.12
  Bottom 0.406: E6.3 35.56,92.08 34.29,90.81 34.29,89.53 34.93,88.9 38.1,88.9 38.74,88.27 v38.74,80.01
N$5
  Top 0.406: E3.7 63.5,50.8 C10.1 R6.2
N$6
  Top 0.406: E3.6 66.04,50.8 C10.2
N$7
  Top 0.406: C9.1 R5.2 E3.15
  Bottom 0.406: C9.1 E2.4
N$8
  Top 0.406: C9.2 71.12,35.56 E3.14
N$9
  Top 0.406: E6.11 46.99,76.2 60.96,76.2 E5.10
N$10  (via drill 0.81)
  Top 0.406: E5.9 59.69,77.47 46.99,77.47 37.47,87 v37.47,87.63 | v33.66,87.63 27.31,87.63 25.4,89.53 E6.8
  Bottom 0.406: v33.66,87.63 v37.47,87.63
N$12  (via drill 0.81)
  Top 0.406: E5.6 64.77,90.17 66.04,90.17 67.31,91.44 v67.95,91.44
  Bottom 0.406: v67.95,91.44 66.04,93.34 66.04,99.69 67.31,100.97 67.31,104.14 71.12,107.95 72.39,107.95 E7.2
N$13
  Top 0.406: E7.15 D1.C
N$14
  Top 0.406: C11.2 71.12,96.52 E7.14
N$15
  Top 0.406: C11.1 R7.2 D1.A
N$16  (via drill 0.81)
  Top 0.406: E5.8 58.42,84.45 55.88,87 v55.88,90.17
  Bottom 0.406: v55.88,90.17 55.88,96.52 E7.10
N$17
  Top 0.406: D2.C E7.7
N$18
  Top 0.406: E7.6 63.5,114.3 C12.2
N$19
  Top 0.406: D2.A C12.1 R8.2
VCC
  Top 0.508: C1.1 E1.24 | 81.28,38.1 82.55,38.1 C3.1 | 81.28,38.1 E3.16 | 81.28,38.1 R5.1 | 80.65,15.88 R4.2 R3.2 | 80.65,15.88 E2.14 | 80.65,15.88 C2.1 | E6.14 44.45,90.17 C6.1 50.8,91.44 | R7.1 88.9,95.25 C7.1 | 50.8,91.44 66.04,91.44 R9.2 | C8.1 48.26,113.67 50.8,111.12 50.8,91.44 | E4.5 34.29,62.23 43.18,62.23 C4.1 71.12,57.15 R6.1 | E5.14 77.47,78.74 78.11,79.38 | C5.1 78.11,79.38 | 78.11,79.38 C13.+ C14.+
  Bottom 0.508: C1.1 69.85,7.62 R1.2 72.39,8.89 73.03,8.89 86.36,22.23 | R4.2 86.36,22.23 | 86.36,22.23 R5.1 | E1.24 43.82,4.45 8.26,4.45 EDGE.AA2 | C8.1 34.29,116.84 E8.5 | R9.2 E7.16 77.47,102.87 80.01,102.87 | 80.01,102.87 C7.1 | R8.1 81.28,109.86 80.01,108.58 80.01,102.87 | C14.+ 72.39,57.15 R6.1 72.39,53.98 83.82,42.55 C3.1 | E4.5 31.75,64.77 24.77,64.77 24.13,64.14 17.15,64.14 16.51,64.77 16.51,73.03 15.88,73.66 8.26,73.66 EDGE.BA2 | R7.1 88.9,90.17 C5.1

### Text on the board
Bottom: VRS | TU10 COMMAND BUFFERS